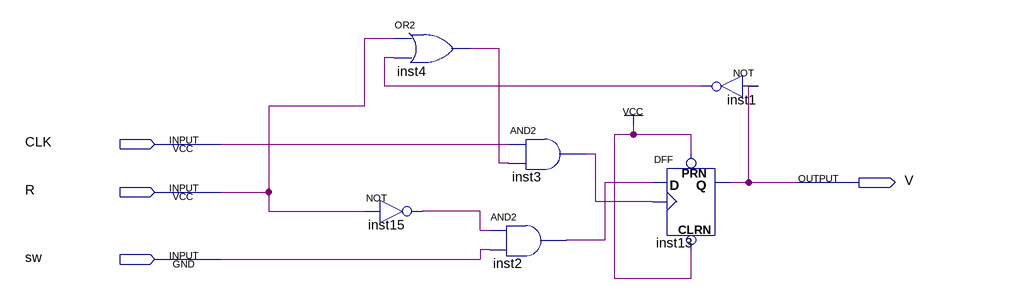
[diagram p0: schematic sheet]
// Quartus schematic sword.bdf as structural Verilog: 6 symbols, 4 pins
module sword (
  input  CLK,
  input  R,
  input  sw,
  output V
);

  wire inst1_out, inst2_out, inst3_out, inst4_out, inst15_out;

  not inst15 (inst15_out, R);
  or inst4 (inst4_out, R, inst1_out);
  and inst3 (inst3_out, CLK, inst4_out);
  and inst2 (inst2_out, inst15_out, sw);
  DFF inst13 (.CLRN(1'b1), .CLK(inst3_out), .D(inst2_out), .PRN(1'b1), .Q(V));
  not inst1 (inst1_out, V);
endmodule
